# Altium schematic sheet LOT_Watch.SchDoc
size A4
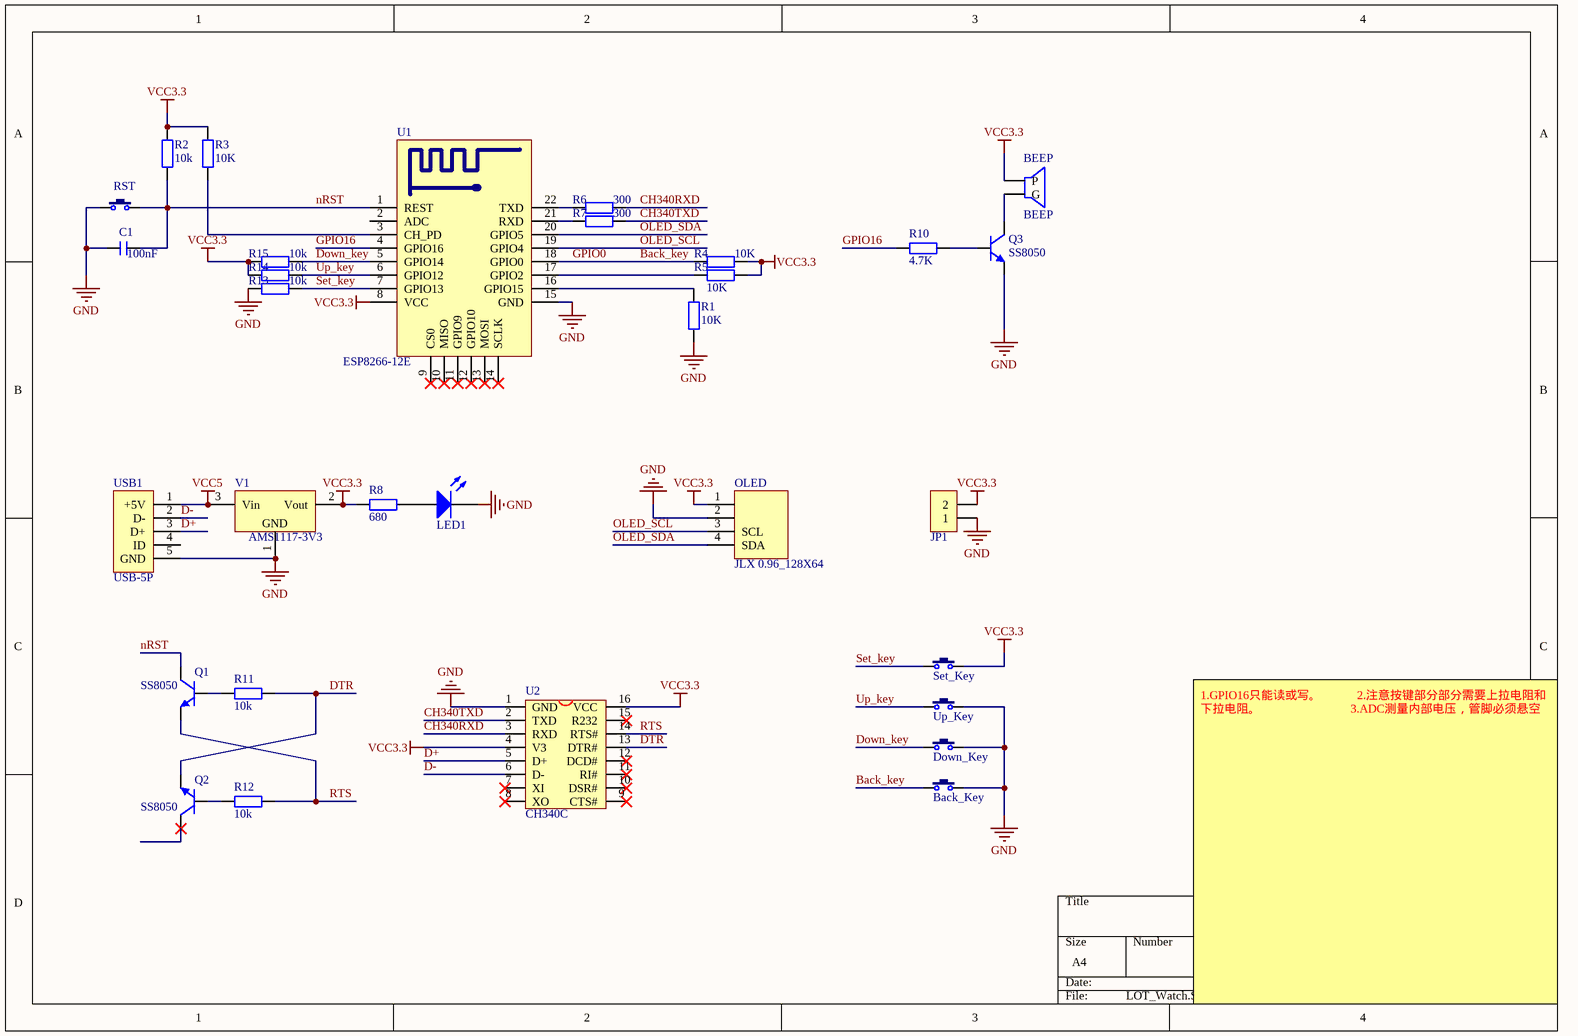
[diagram p0: LOT_Watch.SchDoc]

## Parts
Back_Key  3x6x5  [TSW 3*6*4.3-S-W]  (value not drawn)
BEEP  BEEP  [震动马达]
C1  100nF  [C 0805_L]
Down_Key  3x6x5  [TSW 3*6*4.3-S-W]  (value not drawn)
DS?  LED1  [SMDLED]
JP1  HDR-1X2  [HDR2.54-M-LI-2P]  (value not drawn)
OLED  JLX 0.96_128X64  [0.96_I2C_OLED]
Q1  SS8050  [SOT23-3N]
Q2  SS8050  [SOT23-3N]
Q3  SS8050  [SOT23-3N]
R1  10K  [R 0805_L]
R2  10k  [R 0805_L]
R3  10K  [R 0805_L]
R4  10K  [R 0805_L]
R5  10K  [R 0805_L]
R6  300  [R 0805_L]
R7  300  [R 0805_L]
R8  680  [R 0805_L]
R10  4.7K  [R 0805_L]
R11  10k  [R 0805_L]
R12  10k  [R 0805_L]
R13  10k  [R 0805_L]
R14  10k  [R 0805_L]
R15  10k  [R 0805_L]
RST  3x6x5  [TSW SMD-3*6*2.5]  (value not drawn)
Set_Key  3x6x5  [TSW 3*6*4.3-S-W]  (value not drawn)
U1  ESP8266-12E  [ESP_12E]
U2  CH340C  [SOP16M]
Up_Key  3x6x5  [TSW 3*6*4.3-S-W]  (value not drawn)
USB1  USB-5P  [USB-MICRO_B]
V1  AMS1117-3V3  [SOT223_L]

## Nets
GND: Back_Key.2 C1.1 Down_Key.2 DS?.2(K) JP1.1 OLED.2 Q3.2(E) R1.2 R13.2 RST.1 U1.15(GND) U2.1(GND) Up_Key.2 USB1.5(GND) V1.1(GND)
VCC3.3: BEEP.1(P) JP1.2 OLED.1 R2.2 R3.2 R4.2 R5.1 R8.1 R14.2 R15.2 Set_Key.2 U1.8(VCC) U2.4(V3) U2.16(VCC) V1.2(Vout)
VCC5: USB1.1(+5V) V1.3(Vin)
Back_key: Back_Key.1 R4.1 U1.18(GPIO0)  [also labelled GPIO0]
CH340RXD: R6.1 U2.3(RXD)
CH340TXD: R7.1 U2.2(TXD)
D+: U2.5(D+) USB1.3(D+)
D-: U2.6(D-) USB1.2(D-)
Down_key: Down_Key.1 R15.1 U1.5(GPIO14)
DTR: Q2.2(E) R11.1 U2.13(DTR#)
GPIO16: R10.1 U1.4(GPIO16)
nRST: C1.2 Q1.3(C) R2.1 RST.2 U1.1(REST)
OLED_SCL: OLED.3(SCL) U1.19(GPIO4)
OLED_SDA: OLED.4(SDA) U1.20(GPIO5)
RTS: Q1.2(E) R12.1 U2.14(RTS#)
Set_key: R13.1 Set_Key.1 U1.7(GPIO13)
Up_key: R14.1 U1.6(GPIO12) Up_Key.1
NetBEEP_2: BEEP.2(G) Q3.3(C)
NetDS?_1: DS?.1(A) R8.2
NetQ1_1: Q1.1(B) R11.2
NetQ2_1: Q2.1(B) R12.2
NetQ3_1: Q3.1(B) R10.2
NetR1_1: R1.1 U1.16(GPIO15)
NetR3_1: R3.1 U1.3(CH_PD)
NetR5_2: R5.2 U1.17(GPIO2)
NetR6_2: R6.2 U1.22(TXD)
NetR7_2: R7.2 U1.21(RXD)

Not connected (* = marked no-connect by the designer): Q2 3(C)*; U1 2(ADC) 9(CS0)* 10(MISO)* 11(GPIO9)* 12(GPIO10)* 13(MOSI)* 14(SCLK)*; U2 7(XI)* 8(XO)* 9(CTS#)* 10(DSR#)* 11(RI#)* 12(DCD#)* 15(R232)*; USB1 4(ID)

## Notes on the sheet
- 1.GPIO16只能读或写。            2.注意按键部分部分需要上拉电阻和下拉电阻。                              3.ADC测量内部电压，管脚必须悬空

## Library data of the parts
Back_Key Down_Key RST Set_Key Up_Key = TSW 3x6: 3x6轻触开关; 版权归属: 源创客; BOM名称: 3x6轻触开关; 学习资源: www.ooocke.com
C1 = C: 无极性贴片电容; 版权归属: 源创客; BOM名称: 无极性贴片电容; 学习资源: www.ooocke.com
DS? = LED2: Typical RED, GREEN, YELLOW, AMBER GaAs LED; Published: 8-Jun-2000; LatestRevisionDate: 17-Jul-2002; LatestRevisionNote: Re-released for DXP Platform.; PackageDocument: Feb-2002; PackageReference: 3.2X1.6X1.1; Publisher: Altium Limited
JP1 = Header 2: 2P接插件; 版权归属: 源创客; BOM名称: 2P接插件; 学习资源: www.ooocke.com
OLED = JLX 0.96_128X64: 0.96寸OLED显示屏
Q1-Q3 = 8050-SMD: 高频放大-NPN型; 版权归属: 源创客; 属性: 40V 1.5A 1W 100MHZ; BOM名称: 高频放大-NPN型; 学习资源: www.ooocke.com
R1-R8 R10-R15 = R: 贴片电阻; 版权归属: 源创客; BOM名称: 贴片电阻; 学习资源: www.ooocke.com
U1 = ESP8266-12E: 串口 WIFI模块，ESP-12E; BOM名称: WIFI模块; 版权归属: 源创客; 学习资源: www.ooocke.com
U2 = CH340G: USB2UART
USB1 = USB-5P: 微型USB母座; 版权归属: 源创客; BOM名称: 微型USB母座; 学习资源: www.ooocke.com
V1 = AMS1117: 三端稳压芯片; BOM名称: 稳压芯片; 版权归属: 源创客; 学习资源: www.ooocke.com